# Altium schematic sheet BalanceCarCircuit.SchDoc: Balance Car Electric Circuit
size A4 portrait; Author: PHAM TIEN THANH; CompanyName: University of Engineering and Technology; Engineer: PHAM TIEN THANH; DocumentNumber: 1.0; Revision: 2.0; SheetNumber: 1; SheetTotal: 1; DocumentName: Balance Car Electric Circuit; ProjectName: Graduation thesis
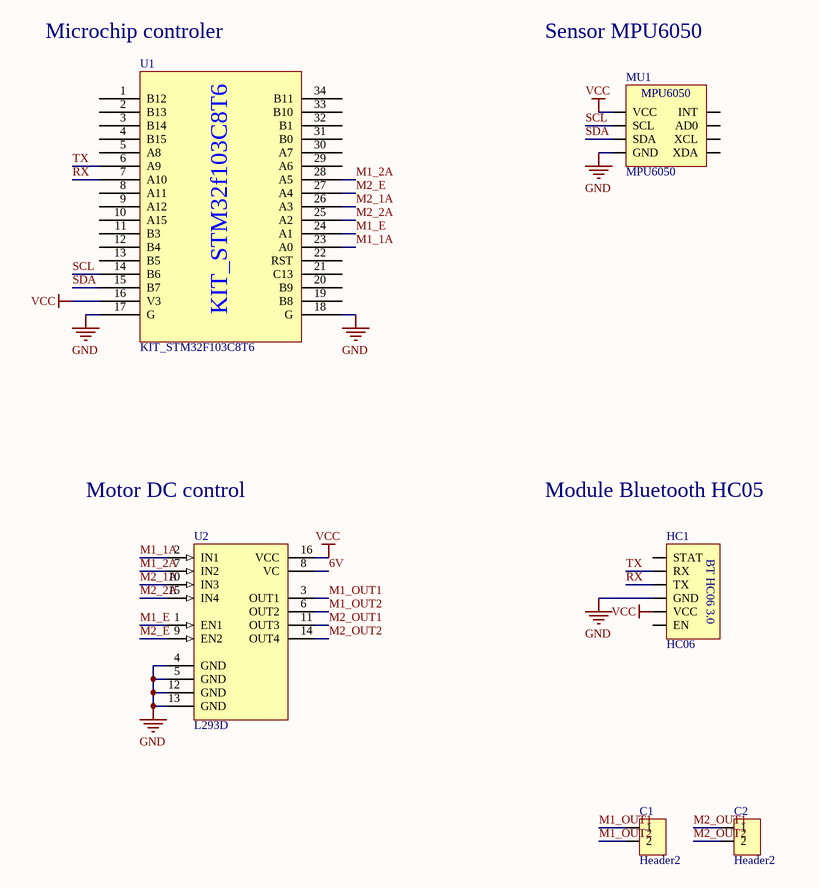
[diagram p0: BalanceCarCircuit.SchDoc]

## Parts
C1  Header2  [Header2]
C2  Header2  [Header2]
HC1  HC06  [HC06]
MU1  MPU6050  [MPU6050]
U1  KIT_STM32F103C8T6  [DIP_KIT_STM32F103C8T6 - duplicate]
U2  L293D  [DIP16]

## Nets
GND: HC1.4(GND) MU1.2(GND) U1.17(G) U1.18(G) U2.4(GND) U2.5(GND) U2.12(GND) U2.13(GND)
VCC: HC1.5(VCC) MU1.1(VCC) U1.16(V3) U2.16(VCC)
6V: U2.8(VC)
M1_1A: U1.23(A0) U2.2(IN1)
M1_2A: U1.28(A5) U2.7(IN2)
M1_E: U1.24(A1) U2.1(EN1)
M1_OUT1: C1.1 U2.3(OUT1)
M1_OUT2: C1.2 U2.6(OUT2)
M2_1A: U1.26(A3) U2.10(IN3)
M2_2A: U1.25(A2) U2.15(IN4)
M2_E: U1.27(A4) U2.9(EN2)
M2_OUT1: C2.1 U2.11(OUT3)
M2_OUT2: C2.2 U2.14(OUT4)
RX: HC1.3(TX) U1.7(A10)
SCL: MU1.3(SCL) U1.14(B6)
SDA: MU1.4(SDA) U1.15(B7)
TX: HC1.2(RX) U1.6(A9)

Not connected (* = marked no-connect by the designer): HC1 1(STAT) 6(EN); MU1 5(XDA) 6(XCL) 7(AD0) 8(INT); U1 1(B12) 2(B13) 3(B14) 4(B15) 5(A8) 8(A11) 9(A12) 10(A15) 11(B3) 12(B4) 13(B5) 19(B8) 20(B9) 21(C13) 22(RST) 29(A6) 30(A7) 31(B0) 32(B1) 33(B10) 34(B11)

## Notes on the sheet
- Microchip controler
- Sensor MPU6050
- Motor DC control
- Module Bluetooth HC05
- Title
- Size:
- Date:
- A4
- Number:
- Time:
- Revision:
- Sheet
- of
- File:
- (in symbol HC06) BT HC06 3.0
- (in symbol KIT_STM32F103C8T6) KIT_STM32f103C8T6

## Library data of the parts
C1 C2 = Header2: Header IDC, 2 x 1 Pin Vertical 2.54mm Pitch (Non-Boxed, Male); Manufacturer: Würth Elektronik eiSos GmbH; partNo: 613002143121; ComponentLink1 Description: Manufacturer; ComponentLink2 Description: Datasheet; NoPins: 02; Created Date: 29 March 2013; ComponentLink1URL: http://www.we-online.com; ComponentLink2URL: http://katalog.we-online.de/em/datasheet/6130xx143121.pdf; Created by: Karrer Zheng
HC1 = HC06: Manufacturer: Würth Elektronik eiSos GmbH; partNo: 613004143121; ComponentLink1 Description: Manufacturer; ComponentLink2 Description: Datasheet; NoPins: 04; Created Date: 29 March 2013; ComponentLink1URL: http://www.we-online.com; ComponentLink2URL: http://katalog.we-online.de/em/datasheet/6130xx143121.pdf; Created by: Karrer Zheng
MU1 = MPU6050: Manufacturer: Würth Elektronik eiSos GmbH; partNo: 613004143121; ComponentLink1 Description: Manufacturer; ComponentLink2 Description: Datasheet; NoPins: 04; Created Date: 29 March 2013; ComponentLink1URL: http://www.we-online.com; ComponentLink2URL: http://katalog.we-online.de/em/datasheet/6130xx143121.pdf; Created by: Karrer Zheng
U1 = KIT_STM32F103C8T6: KIT STM32F103C8T6
U2 = L293D: Push-Pull Four Channel Driver With Diode; Published: 8-Jun-2000; LatestRevisionDate: 06-Jun-2005; LatestRevisionNote: Stylized 3D Model Added.; DatasheetVersion: Jun-1996; PackageVersion: Apr-1996; PackageReference: DIP16; Publisher: Altium Limited; PackageDescription: DIP; 16 Leads; Row Spacing 7.62 mm; Pitch 2.54 mm; ComponentLink1Description: Manufacturer Link; ComponentLink1URL: http://www.st.com/; ComponentLink2Description: Datasheet; ComponentLink2URL: http://www.st.com/stonline/products/literature/ds/1330/l293d.pdf